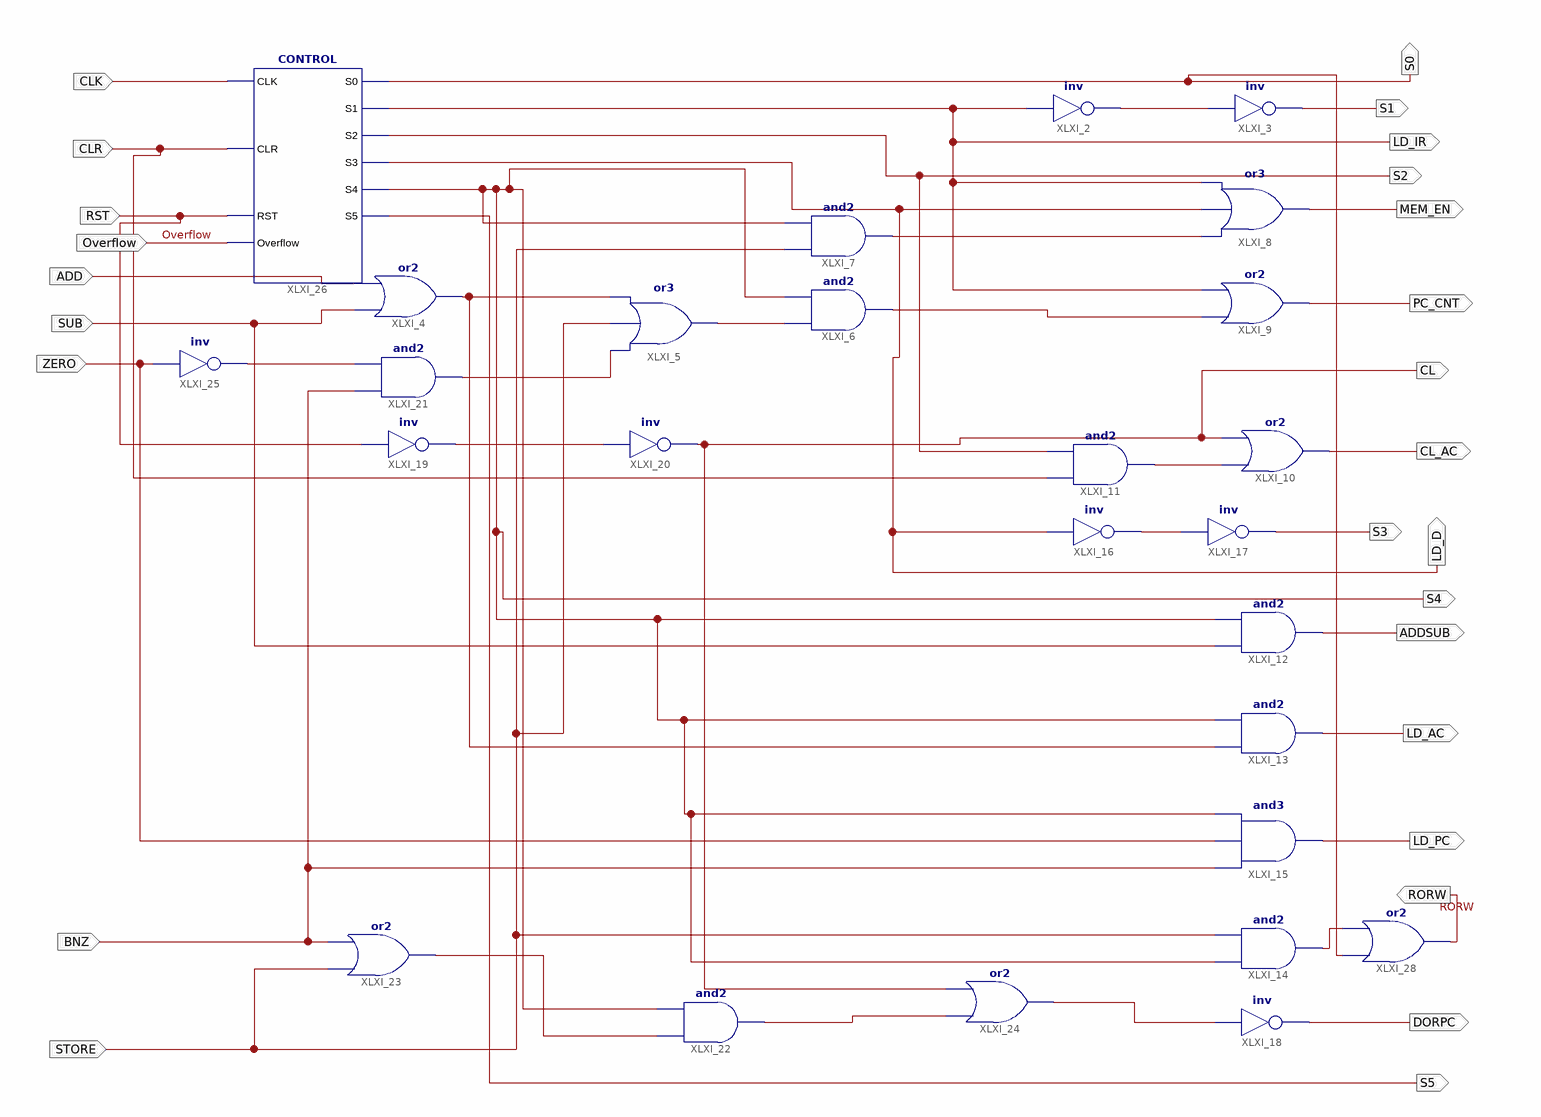
[diagram p0: schematic sheet 1]
// Xilinx ISE schematic controller_sch.sch (spartan3e) as structural Verilog: 26 symbols, 26 ports
module controller_sch (
  input  CLK,
  input  CLR,
  input  RST,
  input  ADD,
  input  SUB,
  input  ZERO,
  input  STORE,
  input  BNZ,
  input  Overflow,
  output S1,
  output CL_AC,
  output CL,
  output PC_CNT,
  output MEM_EN,
  output LD_IR,
  output S2,
  output S3,
  output ADDSUB,
  output LD_AC,
  output LD_PC,
  output DORPC,
  output S5,
  output LD_D,
  output S4,
  output S0,
  output RORW
);

  wire XLXN_6, XLXN_15, XLXN_17, XLXN_18, XLXN_19, XLXN_31, XLXN_34, XLXN_36, XLXN_37, XLXN_43, XLXN_48,
       XLXN_49, XLXN_51, XLXN_55;

  not XLXI_2 (XLXN_6, LD_IR);
  not XLXI_3 (S1, XLXN_6);
  or XLXI_4 (XLXN_43, SUB, ADD);
  or XLXI_5 (XLXN_15, XLXN_18, STORE, XLXN_43);
  and XLXI_6 (XLXN_34, XLXN_15, S4);
  and XLXI_7 (XLXN_31, STORE, S4);
  or XLXI_8 (MEM_EN, XLXN_31, LD_D, LD_IR);
  or XLXI_9 (PC_CNT, XLXN_34, LD_IR);
  or XLXI_10 (CL_AC, XLXN_36, CL);
  and XLXI_11 (XLXN_36, CLR, S2);
  and XLXI_12 (ADDSUB, SUB, S4);
  and XLXI_13 (LD_AC, XLXN_43, S4);
  and XLXI_14 (XLXN_55, S4, STORE);
  and XLXI_15 (LD_PC, BNZ, ZERO, S4);
  not XLXI_16 (XLXN_37, LD_D);
  not XLXI_17 (S3, XLXN_37);
  not XLXI_18 (DORPC, XLXN_48);
  not XLXI_19 (XLXN_19, RST);
  not XLXI_20 (CL, XLXN_19);
  and XLXI_21 (XLXN_18, BNZ, XLXN_17);
  and XLXI_22 (XLXN_49, XLXN_51, S4);
  or XLXI_23 (XLXN_51, STORE, BNZ);
  or XLXI_24 (XLXN_48, XLXN_49, CL);
  not XLXI_25 (XLXN_17, ZERO);
  CONTROL XLXI_26 (
    .CLK(CLK), .CLR(CLR), .RST(RST), .Overflow(Overflow), .S0(S0), .S1(LD_IR), .S2(S2), .S3(LD_D), .S4(S4),
    .S5(S5));
  or XLXI_28 (RORW, S0, XLXN_55);
endmodule
